# Altium project FPGA-Ext.PrjPCB
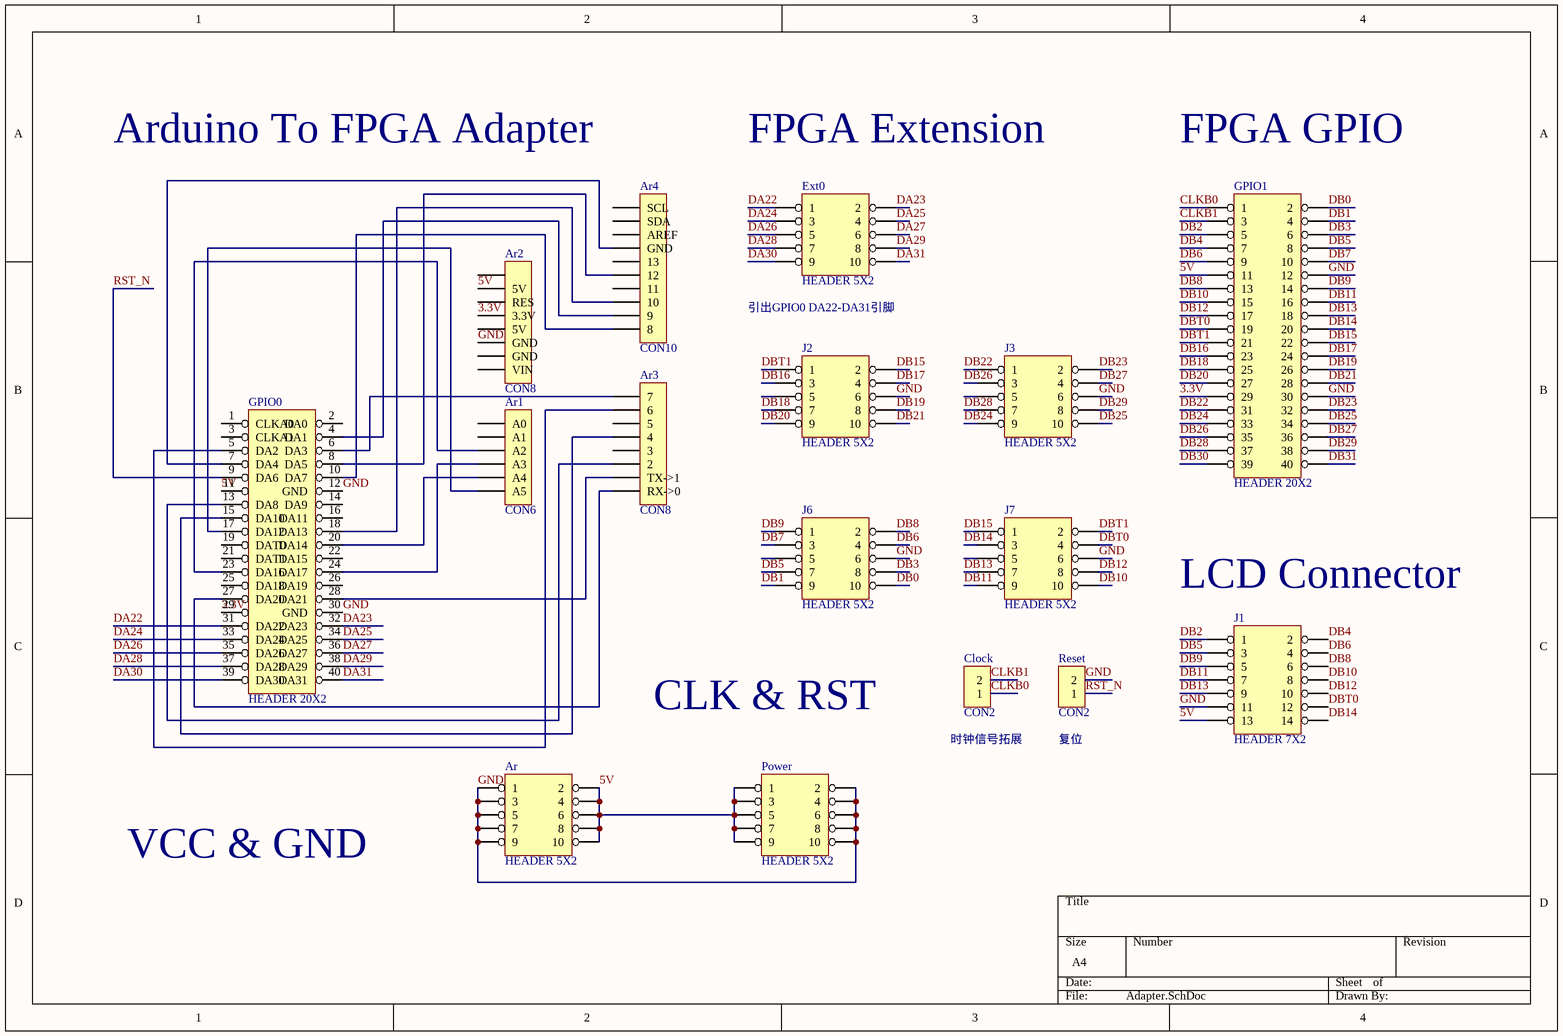
[diagram p0: Adapter.SchDoc]
1 sheet, 16 parts. Net scope: global (net labels, ports and power ports of the same name join across sheets).
Board file: Adapter.PcbDoc

## Sheet Adapter.SchDoc
size A4

### Parts
Ar  HEADER 5X2  [HDR2X5]
Ar1  CON6  [HDR1X6]
Ar2  CON8  [HDR1X8]
Ar3  CON8  [HDR1X8]
Ar4  CON10  [HDR1X10]
Clock  CON2  [HDR1X2]
Ext0  HEADER 5X2  [HDR2X5]
GPIO0  HEADER 20X2  [HDR2X20]
GPIO1  HEADER 20X2  [HDR2X20]
J1  HEADER 7X2  [HDR2X7]
J2  HEADER 5X2  [HDR2X5]
J3  HEADER 5X2  [HDR2X5]
J6  HEADER 5X2  [HDR2X5]
J7  HEADER 5X2  [HDR2X5]
Power  HEADER 5X2  [HDR2X5]
Reset  CON2  [HDR1X2]

### Nets
3.3V: Ar2.4(3.3V) GPIO0.29 GPIO1.29
5V: Ar.2 Ar.4 Ar.6 Ar.8 Ar.10 Ar2.2(5V) GPIO0.11 GPIO1.11 J1.13 Power.1 Power.3 Power.5 Power.7 Power.9
CLKB0: Clock.1 GPIO1.1
CLKB1: Clock.2 GPIO1.3
DA22: Ext0.1 GPIO0.31(DA22)
DA23: Ext0.2 GPIO0.32(DA23)
DA24: Ext0.3 GPIO0.33(DA24)
DA25: Ext0.4 GPIO0.34(DA25)
DA26: Ext0.5 GPIO0.35(DA26)
DA27: Ext0.6 GPIO0.36(DA27)
DA28: Ext0.7 GPIO0.37(DA28)
DA29: Ext0.8 GPIO0.38(DA29)
DA30: Ext0.9 GPIO0.39(DA30)
DA31: Ext0.10 GPIO0.40(DA31)
DB0: GPIO1.2 J6.10
DB1: GPIO1.4 J6.9
DB2: GPIO1.5 J1.1
DB3: GPIO1.6 J6.8
DB4: GPIO1.7 J1.2
DB5: GPIO1.8 J1.3 J6.7
DB6: GPIO1.9 J1.4 J6.4
DB7: GPIO1.10 J6.3
DB8: GPIO1.13 J1.6 J6.2
DB9: GPIO1.14 J1.5 J6.1
DB10: GPIO1.15 J1.8 J7.10
DB11: GPIO1.16 J1.7 J7.9
DB12: GPIO1.17 J1.10 J7.8
DB13: GPIO1.18 J1.9 J7.7
DB14: GPIO1.20 J1.14 J7.3
DB15: GPIO1.22 J2.2 J7.1
DB16: GPIO1.23 J2.3
DB17: GPIO1.24 J2.4
DB18: GPIO1.25 J2.7
DB19: GPIO1.26 J2.8
DB20: GPIO1.27 J2.9
DB21: GPIO1.28 J2.10
DB22: GPIO1.31 J3.1
DB23: GPIO1.32 J3.2
DB24: GPIO1.33 J3.9
DB25: GPIO1.34 J3.10
DB26: GPIO1.35 J3.3
DB27: GPIO1.36 J3.4
DB28: GPIO1.37 J3.7
DB29: GPIO1.38 J3.8
DB30: GPIO1.39
DB31: GPIO1.40
DBT0: GPIO1.19 J1.12 J7.4
DBT1: GPIO1.21 J2.1 J7.2
GND: Ar.1 Ar.3 Ar.5 Ar.7 Ar.9 Ar2.6(GND) GPIO0.12(GND) GPIO0.30(GND) GPIO1.12 GPIO1.30 J1.11 J2.6 J3.6 J6.6 J7.6 Power.2 Power.4 Power.6 Power.8 Power.10 Reset.2
RST_N: GPIO0.9(DA6) Reset.1
NetAr1_3: Ar1.3(A2) GPIO0.23(DA16)
NetAr1_4: Ar1.4(A3) GPIO0.24(DA17)
NetAr1_5: Ar1.5(A4) GPIO0.20(DA14)
NetAr1_6: Ar1.6(A5) GPIO0.17(DA12)
NetAr3_1: Ar3.1(7) GPIO0.6(DA3)
NetAr3_2: Ar3.2(6) GPIO0.5(DA2)
NetAr3_4: Ar3.4 GPIO0.15(DA10)
NetAr3_6: Ar3.6(2) GPIO0.13(DA8)
NetAr3_7: Ar3.7(TX->1) GPIO0.28(DA21)
NetAr3_8: Ar3.8(RX->0) GPIO0.27(DA20)
NetAr4_4: Ar4.4(GND) GPIO0.7(DA4)
NetAr4_6: Ar4.6(12) GPIO0.8(DA5)
NetAr4_8: Ar4.8(10) GPIO0.18(DA13)
NetAr4_9: Ar4.9 GPIO0.4(DA1)
NetAr4_10: Ar4.10(8) GPIO0.10(DA7)

Not connected (* = marked no-connect by the designer): Ar1 1(A0) 2(A1); Ar2 1 3(RES) 5(5V) 7(GND) 8(VIN); Ar3 3(5) 5(3); Ar4 1(SCL) 2(SDA) 3(AREF) 5(13) 7(11); GPIO0 1(CLKA0) 2(DA0) 3(CLKA1) 14(DA9) 16(DA11) 19(DAT0) 21(DAT1) 22(DA15) 25(DA18) 26(DA19); J2 5; J3 5; J6 5; J7 5

### Notes on the sheet
- Arduino To FPGA Adapter
- FPGA Extension
- FPGA GPIO
- 引出GPIO0 DA22-DA31引脚
- (near J1) LCD Connector
- CLK & RST
- (near Clock) 时钟信号拓展
- (near Reset) 复位
- VCC & GND

### Library data of the parts
Clock Reset = CON2: Connector